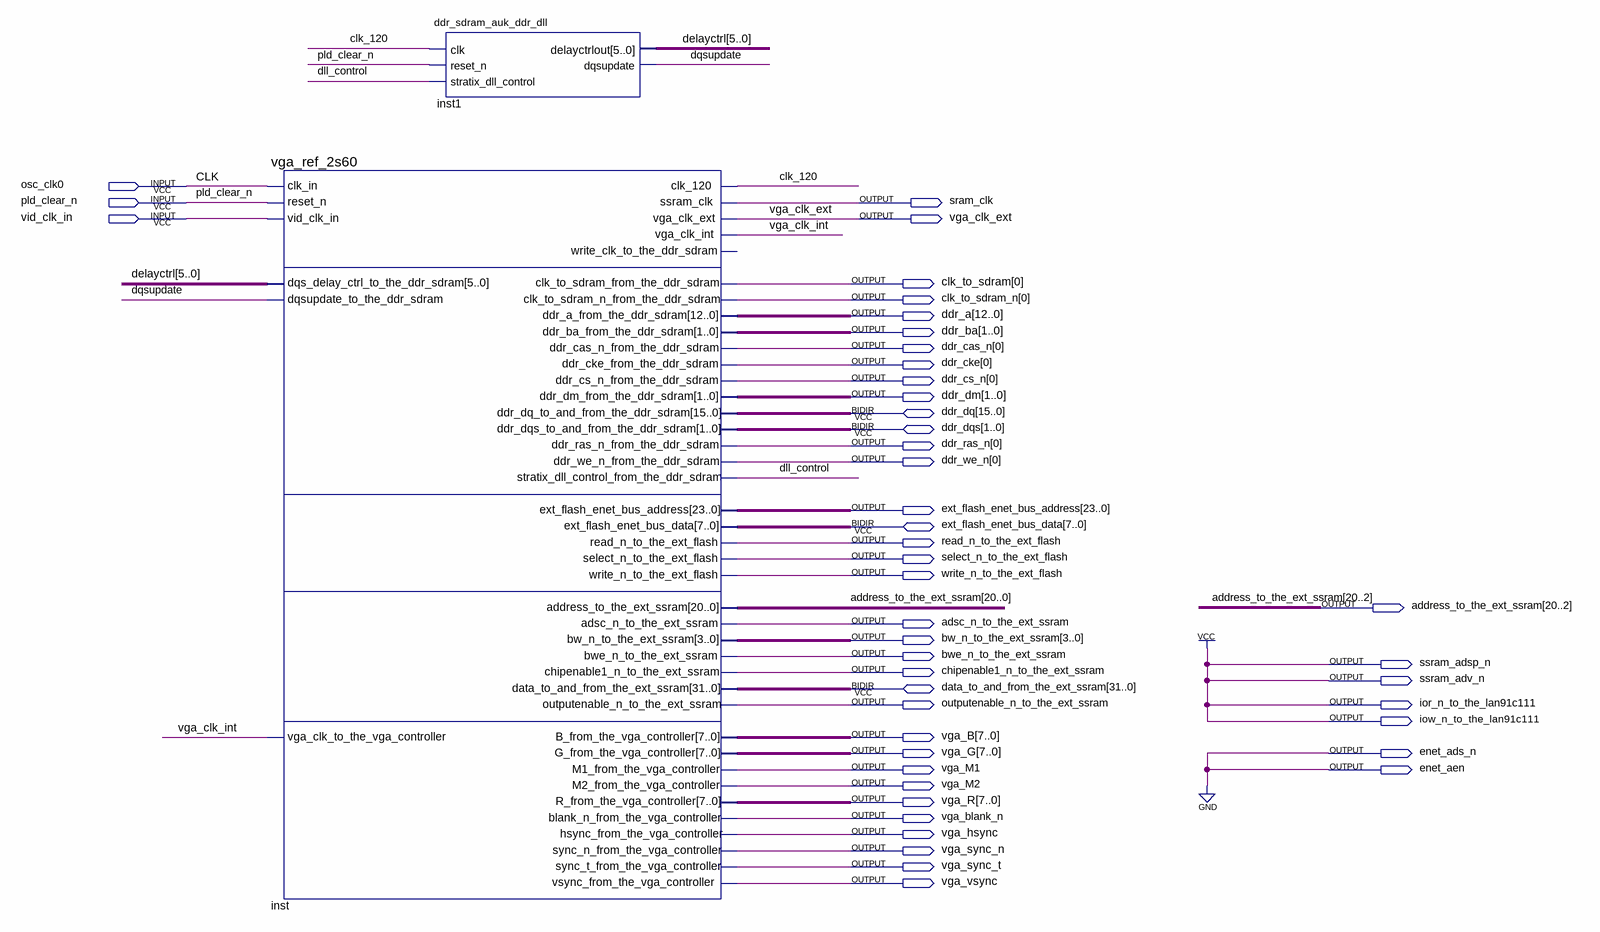
[diagram p0: schematic sheet]
// Quartus schematic vga_ref.bdf as structural Verilog: 2 symbols, 45 pins
module vga_ref (
  input  osc_clk0,
  input  pld_clear_n,
  input  vid_clk_in,
  inout  [15:0] ddr_dq,
  inout  [1:0] ddr_dqs,
  inout  [7:0] ext_flash_enet_bus_data,
  inout  [31:0] data_to_and_from_the_ext_ssram,
  output sram_clk,
  output vga_clk_ext,
  output [0:0] clk_to_sdram,
  output [0:0] clk_to_sdram_n,
  output [12:0] ddr_a,
  output [1:0] ddr_ba,
  output [0:0] ddr_cas_n,
  output [0:0] ddr_cke,
  output [0:0] ddr_cs_n,
  output [1:0] ddr_dm,
  output [0:0] ddr_ras_n,
  output [0:0] ddr_we_n,
  output [23:0] ext_flash_enet_bus_address,
  output read_n_to_the_ext_flash,
  output select_n_to_the_ext_flash,
  output write_n_to_the_ext_flash,
  output [20:0] address_to_the_ext_ssram,
  output adsc_n_to_the_ext_ssram,
  output [3:0] bw_n_to_the_ext_ssram,
  output bwe_n_to_the_ext_ssram,
  output ssram_adsp_n,
  output chipenable1_n_to_the_ext_ssram,
  output ssram_adv_n,
  output outputenable_n_to_the_ext_ssram,
  output ior_n_to_the_lan91c111,
  output iow_n_to_the_lan91c111,
  output [7:0] vga_B,
  output [7:0] vga_G,
  output enet_ads_n,
  output vga_M1,
  output enet_aen,
  output vga_M2,
  output [7:0] vga_R,
  output vga_blank_n,
  output vga_hsync,
  output vga_sync_n,
  output vga_sync_t,
  output vga_vsync
);

  wire clk_120, dll_control, dqsupdate, vga_clk_int;
  wire [5:0] delayctrl;

  vga_ref_2s60 inst (
    .clk_in(osc_clk0), .reset_n(pld_clear_n), .vid_clk_in(vid_clk_in),
    .dqs_delay_ctrl_to_the_ddr_sdram(delayctrl), .dqsupdate_to_the_ddr_sdram(dqsupdate),
    .vga_clk_to_the_vga_controller(vga_clk_int), .clk_120(clk_120), .ssram_clk(sram_clk),
    .vga_clk_ext(vga_clk_ext), .vga_clk_int(vga_clk_int), .clk_to_sdram_from_the_ddr_sdram(clk_to_sdram[0]),
    .clk_to_sdram_n_from_the_ddr_sdram(clk_to_sdram_n[0]), .ddr_a_from_the_ddr_sdram(ddr_a),
    .ddr_ba_from_the_ddr_sdram(ddr_ba), .ddr_cas_n_from_the_ddr_sdram(ddr_cas_n[0]),
    .ddr_cke_from_the_ddr_sdram(ddr_cke[0]), .ddr_cs_n_from_the_ddr_sdram(ddr_cs_n[0]),
    .ddr_dm_from_the_ddr_sdram(ddr_dm), .ddr_ras_n_from_the_ddr_sdram(ddr_ras_n[0]),
    .ddr_we_n_from_the_ddr_sdram(ddr_we_n[0]), .stratix_dll_control_from_the_ddr_sdram(dll_control),
    .ext_flash_enet_bus_address(ext_flash_enet_bus_address),
    .read_n_to_the_ext_flash(read_n_to_the_ext_flash), .select_n_to_the_ext_flash(select_n_to_the_ext_flash),
    .write_n_to_the_ext_flash(write_n_to_the_ext_flash), .address_to_the_ext_ssram(address_to_the_ext_ssram),
    .adsc_n_to_the_ext_ssram(adsc_n_to_the_ext_ssram), .bw_n_to_the_ext_ssram(bw_n_to_the_ext_ssram),
    .bwe_n_to_the_ext_ssram(bwe_n_to_the_ext_ssram),
    .chipenable1_n_to_the_ext_ssram(chipenable1_n_to_the_ext_ssram),
    .outputenable_n_to_the_ext_ssram(outputenable_n_to_the_ext_ssram), .B_from_the_vga_controller(vga_B),
    .G_from_the_vga_controller(vga_G), .M1_from_the_vga_controller(vga_M1),
    .M2_from_the_vga_controller(vga_M2), .R_from_the_vga_controller(vga_R),
    .blank_n_from_the_vga_controller(vga_blank_n), .hsync_from_the_vga_controller(vga_hsync),
    .sync_n_from_the_vga_controller(vga_sync_n), .sync_t_from_the_vga_controller(vga_sync_t),
    .vsync_from_the_vga_controller(vga_vsync), .ddr_dq_to_and_from_the_ddr_sdram(ddr_dq),
    .ddr_dqs_to_and_from_the_ddr_sdram(ddr_dqs), .ext_flash_enet_bus_data(ext_flash_enet_bus_data),
    .data_to_and_from_the_ext_ssram(data_to_and_from_the_ext_ssram));  // open: write_clk_to_the_ddr_sdram
  ddr_sdram_auk_ddr_dll inst1 (
    .clk(clk_120), .reset_n(pld_clear_n), .stratix_dll_control(dll_control), .delayctrlout(delayctrl),
    .dqsupdate(dqsupdate));

  assign enet_ads_n = 1'b0;
  assign enet_aen = 1'b0;
  assign ior_n_to_the_lan91c111 = 1'b1;
  assign iow_n_to_the_lan91c111 = 1'b1;
  assign ssram_adsp_n = 1'b1;
  assign ssram_adv_n = 1'b1;

  // Other names for the same wires on the sheet: CLK = osc_clk0
endmodule
